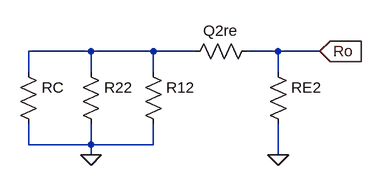
[diagram p0: schematic Ro_AC_equiv.asc]
Ro_AC_equiv.asc, the LTspice schematic file:
Version 4
SHEET 1 880 680
WIRE 64 112 -32 112
WIRE 160 112 64 112
WIRE 224 112 160 112
WIRE 352 112 304 112
WIRE 416 112 352 112
WIRE -32 144 -32 112
WIRE 64 144 64 112
WIRE 160 144 160 112
WIRE 352 144 352 112
WIRE -32 256 -32 224
WIRE 64 256 64 224
WIRE 64 256 -32 256
WIRE 160 256 160 224
WIRE 160 256 64 256
WIRE 64 272 64 256
WIRE 352 272 352 224
FLAG 64 272 0
FLAG 352 272 0
FLAG 416 112 Ro
IOPIN 416 112 In
SYMBOL res 336 128 R0
SYMATTR InstName RE2
SYMATTR Value ""
SYMBOL res 144 128 R0
SYMATTR InstName R12
SYMATTR Value ""
SYMBOL res 48 128 R0
SYMATTR InstName R22
SYMATTR Value ""
SYMBOL res -48 128 R0
SYMATTR InstName RC
SYMATTR Value ""
SYMBOL res 320 96 R90
WINDOW 0 0 56 VBottom 2
WINDOW 3 32 56 VTop 2
SYMATTR InstName Q2re
SYMATTR Value ""

The netlist it stands for:
* Ro_AC_equiv.asc
RE2 Ro 0
R12 N001 0
R22 N001 0
RC N001 0
R§Q2re Ro N001
.backanno
.end